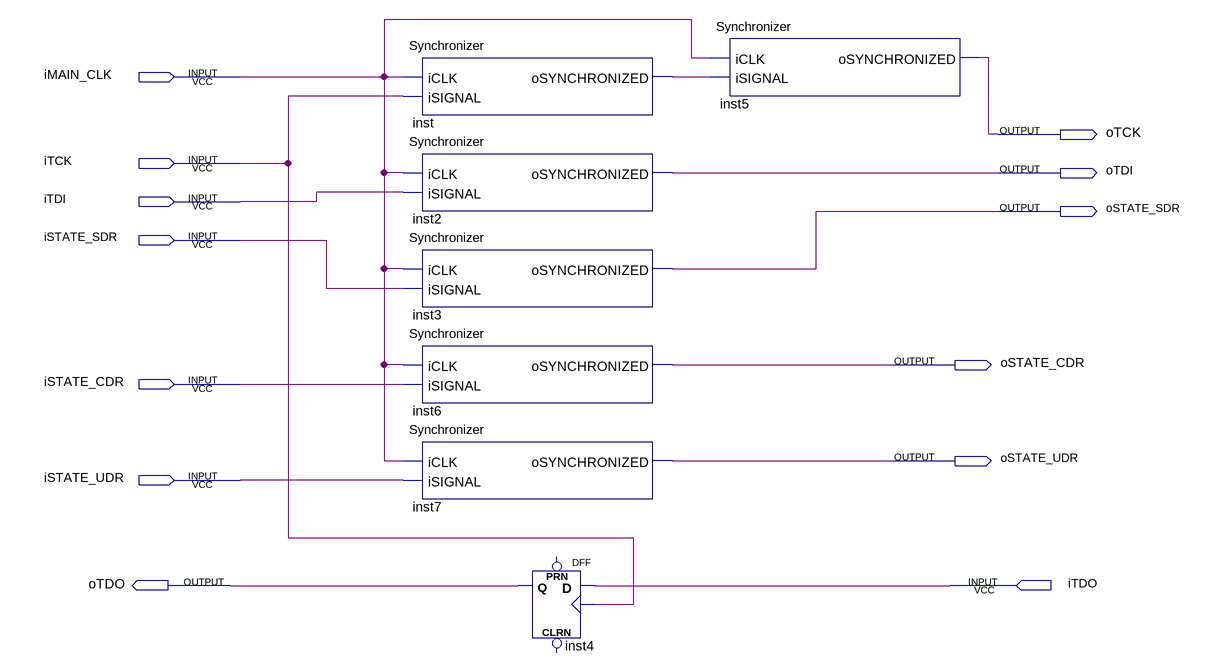
[diagram p0: schematic sheet]
// Quartus schematic JTAG_Synchronizer.bdf as structural Verilog: 7 symbols, 13 pins
module JTAG_Synchronizer (
  input  iMAIN_CLK,
  input  iTCK,
  input  iTDI,
  input  iSTATE_SDR,
  input  iSTATE_CDR,
  input  iSTATE_UDR,
  input  iTDO,
  output oTCK,
  output oTDI,
  output oSTATE_SDR,
  output oSTATE_CDR,
  output oSTATE_UDR,
  output oTDO
);

  wire inst_osynchronized;

  Synchronizer inst (.iCLK(iMAIN_CLK), .iSIGNAL(iTCK), .oSYNCHRONIZED(inst_osynchronized));
  Synchronizer inst2 (.iCLK(iMAIN_CLK), .iSIGNAL(iTDI), .oSYNCHRONIZED(oTDI));
  Synchronizer inst3 (.iCLK(iMAIN_CLK), .iSIGNAL(iSTATE_SDR), .oSYNCHRONIZED(oSTATE_SDR));
  Synchronizer inst6 (.iCLK(iMAIN_CLK), .iSIGNAL(iSTATE_CDR), .oSYNCHRONIZED(oSTATE_CDR));
  Synchronizer inst7 (.iCLK(iMAIN_CLK), .iSIGNAL(iSTATE_UDR), .oSYNCHRONIZED(oSTATE_UDR));
  DFF inst4 (.CLK(iTCK), .D(iTDO), .Q(oTDO));  // open: CLRN, PRN
  Synchronizer inst5 (.iCLK(iMAIN_CLK), .iSIGNAL(inst_osynchronized), .oSYNCHRONIZED(oTCK));
endmodule
